# Altium schematic sheet RX.SchDoc
size A4
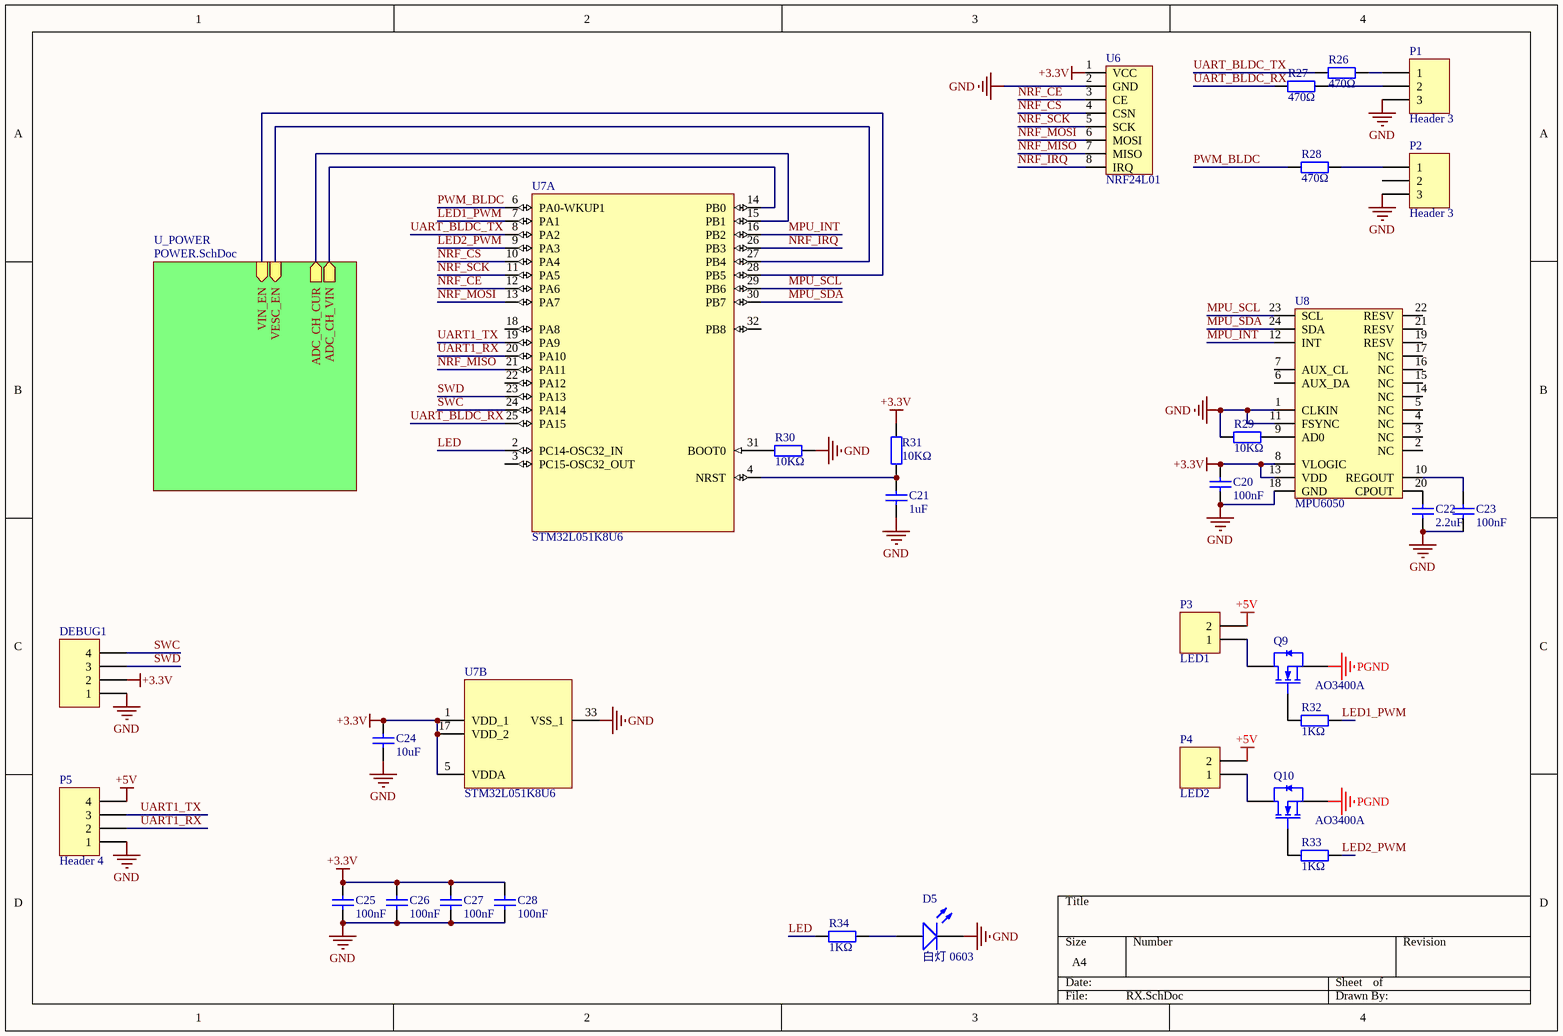
[diagram p0: RX.SchDoc]

## Parts
C20  100nF  [0402_C]
C21  1uF  [0402_C]
C22  2.2uF  [0402_C]
C23  100nF  [0402_C]
C24  10uF  [0603_C]
C25  100nF  [0402_C]
C26  100nF  [0402_C]
C27  100nF  [0402_C]
C28  100nF  [0402_C]
D5  白灯 0603  [0603_LED_S1]
DEBUG1  Header 4  [HDR2.54-LI-4P]  (value not drawn)
P1  Header 3  [HDR2.54-LI-3P]
P2  Header 3  [HDR2.54-LI-3P]
P3  LED1  [HDR1X2]
P4  LED2  [HDR1X2]
P5  Header 4  [HDR2.54-LI-4P]
Q9  AO3400A  [SOT-23-3L]
Q10  AO3400A  [SOT-23-3L]
R26  470Ω  [0402_R]
R27  470Ω  [0402_R]
R28  470Ω  [0402_R]
R29  10KΩ  [0402_R]
R30  10KΩ  [0402_R]
R31  10KΩ  [0402_R]
R32  1KΩ  [0402_R]
R33  1KΩ  [0402_R]
R34  1KΩ  [0402_R]
U6  NRF24L01  [miniNRF24L01]
U7  STM32L051K8U6  [UFQFPN32-5x5mm]  (parts A,B of 2)
U8  MPU6050  [QFN-24_4x4x05P]

## Sub-sheets
U_POWER = POWER.SchDoc: ADC_CH_CUR (out), VESC_EN (in), ADC_CH_VIN (out), VIN_EN (in)

## Nets
+3.3V: C20.2 C24.2 C25.2 C26.2 C27.2 C28.2 DEBUG1.2 R31.2 U6.1(VCC) U7.1(VDD_1) U7.5(VDDA) U7.17(VDD_2) U8.8(VLOGIC) U8.13(VDD)
+5V: P3.2 P4.2 P5.4
GND: C20.1 C21.1 C22.1 C23.1 C24.1 C25.1 C26.1 C27.1 C28.1 D5.K DEBUG1.1 P1.3 P2.3 P5.1 R29.1 R30.1 U6.2(GND) U7.33(VSS_1) U8.1(CLKIN) U8.11(FSYNC) U8.18(GND)
PGND: Q9.2(S) Q10.2(S)
LED: R34.1 U7.2(PC14-OSC32_IN)
LED1_PWM: R32.2 U7.7(PA1)
LED2_PWM: R33.2 U7.9(PA3)
MPU_INT: U7.16(PB2) U8.12(INT)
MPU_SCL: U7.29(PB6) U8.23(SCL)
MPU_SDA: U7.30(PB7) U8.24(SDA)
NRF_CE: U6.3(CE) U7.12(PA6)
NRF_CS: U6.4(CSN) U7.10(PA4)
NRF_IRQ: U6.8(IRQ) U7.26(PB3)
NRF_MISO: U6.7(MISO) U7.21(PA11)
NRF_MOSI: U6.6(MOSI) U7.13(PA7)
NRF_SCK: U6.5(SCK) U7.11(PA5)
PWM_BLDC: R28.1 U7.6(PA0-WKUP1)
SWC: DEBUG1.4 U7.24(PA14)
SWD: DEBUG1.3 U7.23(PA13)
UART1_RX: P5.2 U7.20(PA10)
UART1_TX: P5.3 U7.19(PA9)
UART_BLDC_RX: R27.1 U7.25(PA15)
UART_BLDC_TX: R26.1 U7.8(PA2)
NetC21_2: C21.2 R31.1 U7.4(NRST)
NetC22_2: C22.2 U8.20(CPOUT)
NetC23_2: C23.2 U8.10(REGOUT)
NetD5_A: D5.A R34.2
NetP1_1: P1.1 R26.2
NetP1_2: P1.2 R27.2
NetP2_1: P2.1 R28.2
NetP3_1: P3.1 Q9.3(D)
NetP4_1: P4.1 Q10.3(D)
NetQ9_1: Q9.1(G) R32.1
NetQ10_1: Q10.1(G) R33.1
NetR29_2: R29.2 U8.9(AD0)
NetR30_2: R30.2 U7.31(BOOT0)
NetU7_14: U7.14(PB0) ; sheet U_POWER/ADC_CH_VIN
NetU7_15: U7.15(PB1) ; sheet U_POWER/ADC_CH_CUR
NetU7_27: U7.27(PB4) ; sheet U_POWER/VESC_EN
NetU7_28: U7.28(PB5) ; sheet U_POWER/VIN_EN

Not connected (* = marked no-connect by the designer): P2 2; U7 3(PC15-OSC32_OUT) 18(PA8) 22(PA12) 32(PB8); U8 2(NC) 3(NC) 4(NC) 5(NC) 6(AUX_DA) 7(AUX_CL) 14(NC) 15(NC) 16(NC) 17(NC) 19(RESV) 21(RESV) 22(RESV)

## Library data of the parts
C20 C23 C25-C28 = 0402 100nF (104) 10% 16V: 贴片电容; ComponentLink1Description: 供应商链接; ComponentLink1URL: http://www.szlcsc.com/product/details_1877.html; Package: 0402; Supplier: LC; SuppliersPartNumber: C1525
C21 = 0603 1uF (105) 10% 50V: 贴片电容; ComponentLink1Description: 供应商链接; ComponentLink1URL: http://www.szlcsc.com/product/details_16531.html; Package: 0603; Supplier: LC; SuppliersPartNumber: C15849
C22 C24 = 0603 10uF (106) 10% 10V: 贴片电容; ComponentLink1Description: 供应商链接; ComponentLink1URL: http://www.szlcsc.com/product/details_20411.html; Package: 0603; Supplier: LC; SuppliersPartNumber: C19702
D5 = 0603 白灯: 发光二极管; ComponentLink1Description: 供应商链接; ComponentLink1URL: http://www.szlcsc.com/product/details_2663.html; Package: 0603; Supplier: LC; SuppliersPartNumber: C2290
DEBUG1 P5 = Header 4: Header, 4-Pin; LatestRevisionDate: 17-Jul-2002; LatestRevisionNote: Re-released for DXP Platform.; Publisher: Altium Limited
P1 P2 = Header 3: Header, 3-Pin; LatestRevisionDate: 17-Jul-2002; LatestRevisionNote: Re-released for DXP Platform.; Publisher: Altium Limited
P3 P4 = Header 2: Header, 2-Pin; LatestRevisionDate: 17-Jul-2002; LatestRevisionNote: Re-released for DXP Platform.; Publisher: Altium Limited
Q9 Q10 = AO3400A N道沟 X0YV1T SOT-23: MOS(场效应管); ComponentLink1Description: 供应商链接; ComponentLink1URL: http://www.szlcsc.com/product/details_21629.html; Package: SOT-23; Supplier: LC; SuppliersPartNumber: C20917
R26-R28 = 0402 470Ω (4700) 1%: 贴片电阻; ComponentLink1Description: 供应商链接; ComponentLink1URL: http://www.szlcsc.com/product/details_25860.html; Package: 0402; Supplier: LC; SuppliersPartNumber: C25117
R29-R31 = 0402 10KΩ (1002) 1%: 贴片电阻; ComponentLink1Description: 供应商链接; ComponentLink1URL: http://www.szlcsc.com/product/details_26487.html; Package: 0402; Supplier: LC; SuppliersPartNumber: C25744
R32-R34 = 0402 1KΩ (1001) 1%: 贴片电阻; ComponentLink1Description: 供应商链接; ComponentLink1URL: http://www.szlcsc.com/product/details_12256.html; Package: 0402; Supplier: LC; SuppliersPartNumber: C11702
U7 = STM32L051K8U6: ARM; ComponentLink1Description: 供应商链接; ComponentLink1URL: http://www.szlcsc.com/product/details_10393.html; Package: LQFP-48_7x7x05P; Supplier: LC; SuppliersPartNumber: C9861
U8 = MPU6050: 9轴运动处理传感器